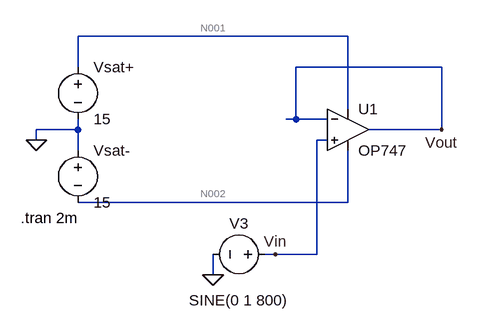
[diagram p0: schematic SOURCE_FOLLOWER.asc]
SOURCE_FOLLOWER.asc, the LTspice schematic file:
Version 4
SHEET 1 880 680
WIRE 336 16 -80 16
WIRE -80 64 -80 16
WIRE 480 64 256 64
WIRE 336 128 336 16
WIRE 256 144 256 64
WIRE 256 144 240 144
WIRE 304 144 256 144
WIRE -80 160 -80 144
WIRE -80 160 -144 160
WIRE 480 160 480 64
WIRE 480 160 368 160
WIRE -144 176 -144 160
WIRE 304 176 288 176
WIRE -80 192 -80 160
WIRE 336 272 336 192
WIRE 336 272 -80 272
WIRE 224 352 208 352
WIRE 288 352 288 176
WIRE 288 352 224 352
WIRE 128 384 128 352
FLAG -144 176 0
FLAG 128 384 0
FLAG 480 160 Vout
FLAG 224 352 Vin
SYMBOL OpAmps\\OP747 336 96 R0
SYMATTR InstName U1
SYMBOL voltage -80 48 R0
WINDOW 123 0 0 Left 0
WINDOW 39 0 0 Left 0
SYMATTR InstName Vsat+
SYMATTR Value 15
SYMBOL voltage -80 176 R0
WINDOW 123 0 0 Left 0
WINDOW 39 0 0 Left 0
SYMATTR InstName Vsat-
SYMATTR Value 15
SYMBOL voltage 224 352 R90
WINDOW 0 -32 56 VBottom 2
WINDOW 3 55 56 VTop 2
WINDOW 123 0 0 Left 0
WINDOW 39 0 0 Left 0
SYMATTR InstName V3
SYMATTR Value SINE(0 1 800)
TEXT -168 296 Left 2 !.tran 2m

The netlist it stands for:
* SOURCE_FOLLOWER.asc
XU1 Vin Vout N001 N002 Vout OP747  ; pins In+ In- V+ V- OUT
Vsat+ N001 0 15
Vsat- 0 N002 15
V3 Vin 0 SINE(0 1 800)
.tran 2m
.backanno
.end

* Results of the author's LTspice run, read from the files saved beside the schematic
* Operating Point, zero values left out:
*   V(vout) = 80 µV
*   V(n002) = -15 V
*   V(n001) = 15 V
*   I(V3) = 10.86 nA
*   I(Vsat-) = -304.4 µA
*   I(Vsat+) = -304.4 µA
*   Ix(u1:1) = -10.86 nA
*   Ix(u1:2) = -8.856 nA
*   Ix(u1:99) = 304.4 µA
*   Ix(u1:50) = -304.4 µA
*   Ix(u1:45) = 8.856 nA
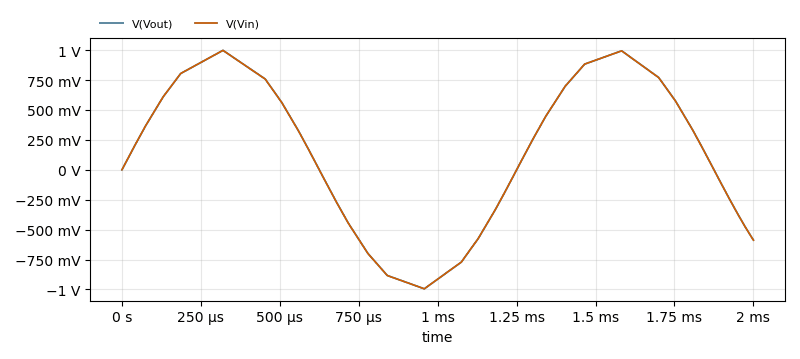
[diagram p1: Transient Analysis of SOURCE_FOLLOWER.asc, plotted from the saved traces]
* Transient Analysis, 1 run:
*   V(Vout): min -994.2 mV, max 998.2 mV, average 174.9 mV, rms 677.9 mV, last -586.8 mV
*   V(Vin): min -994.2 mV, max 998.1 mV, average 174.8 mV, rms 678 mV, last -587.8 mV